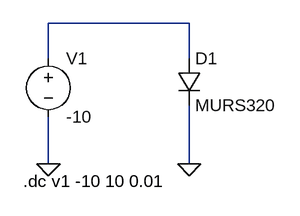
[diagram p0: schematic Draft1.asc]
Draft1.asc, the LTspice schematic file:
Version 4
SHEET 1 880 680
WIRE 336 0 144 0
WIRE 144 48 144 0
WIRE 336 48 336 0
WIRE 144 192 144 128
WIRE 336 192 336 112
FLAG 144 192 0
FLAG 336 192 0
SYMBOL voltage 144 32 R0
WINDOW 123 0 0 Left 0
WINDOW 39 0 0 Left 0
SYMATTR InstName V1
SYMATTR Value -10
SYMBOL diode 320 48 R0
SYMATTR InstName D1
SYMATTR Value MURS320
TEXT 110 216 Left 2 !.dc v1 -10 10 0.01

The netlist it stands for:
* Draft1.asc
V1 N001 0 -10
D1 N001 0 MURS320
.model D D
.lib standard.dio
.dc v1 -10 10 0.01
.backanno
.end